# EasyEDA Pro project IMU_Splitter.eprj

# Schematic Schematic1
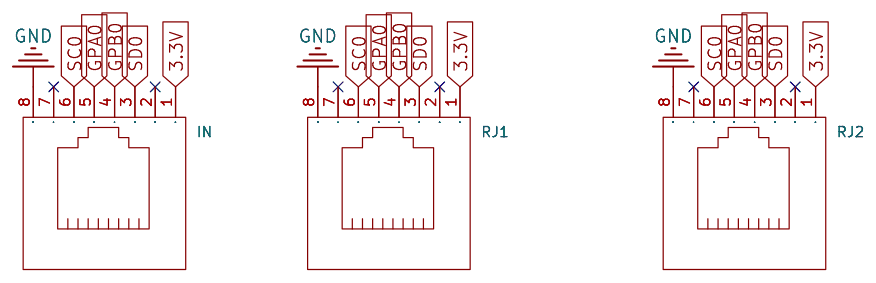
[diagram p0: schematic sheet]

## Parts
IN  -  [RJ45-TH_R-RJ45R08P-A009]
RJ1  -  [RJ45-TH_R-RJ45R08P-A009]
RJ2  -  [RJ45-TH_R-RJ45R08P-A009]

## Library data of the parts
IN RJ1 RJ2 = R-RJ45R08P-A009: Supplier Part: C2902700; Manufacturer: Ckmtw(灿科盟); Supplier Footprint: 插件; JLCPCB Part Class: Extended Part; Datasheet: https://atta.szlcsc.com/upload/public/pdf/source/20211021/D54662BD8381AD1D1DF920996089EE18.pdf; Supplier: LCSC

## Nets
3.3V: IN.1 RJ1.1 RJ2.1
GND: IN.8 RJ1.8 RJ2.8
GPA0: IN.5 RJ1.5 RJ2.5
GPB0: IN.4 RJ1.4 RJ2.4
SC0: IN.6 RJ1.6 RJ2.6
SD0: IN.3 RJ1.3 RJ2.3

Not connected (* = marked no-connect by the designer): IN 2* 7*; RJ1 2* 7*; RJ2 2* 7*

# Schematic Schematic2
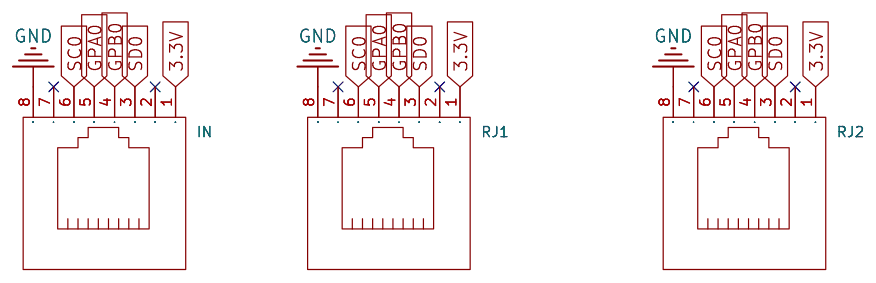
[diagram p1: schematic sheet]

## Parts
IN  -  [RJ45-TH_R-RJ45R08P-A009]
RJ1  -  [RJ45-TH_R-RJ45R08P-A009]
RJ2  -  [RJ45-TH_R-RJ45R08P-A009]

## Library data of the parts
IN RJ1 RJ2 = R-RJ45R08P-A009: Supplier Part: C2902700; Manufacturer: Ckmtw(灿科盟); Supplier Footprint: 插件; JLCPCB Part Class: Extended Part; Datasheet: https://atta.szlcsc.com/upload/public/pdf/source/20211021/D54662BD8381AD1D1DF920996089EE18.pdf; Supplier: LCSC

## Nets
3.3V: IN.1 RJ1.1 RJ2.1
GND: IN.8 RJ1.8 RJ2.8
GPA0: IN.5 RJ1.5 RJ2.5
GPB0: IN.4 RJ1.4 RJ2.4
SC0: IN.6 RJ1.6 RJ2.6
SD0: IN.3 RJ1.3 RJ2.3

Not connected (* = marked no-connect by the designer): IN 2* 7*; RJ1 2* 7*; RJ2 2* 7*

# Board PCB1
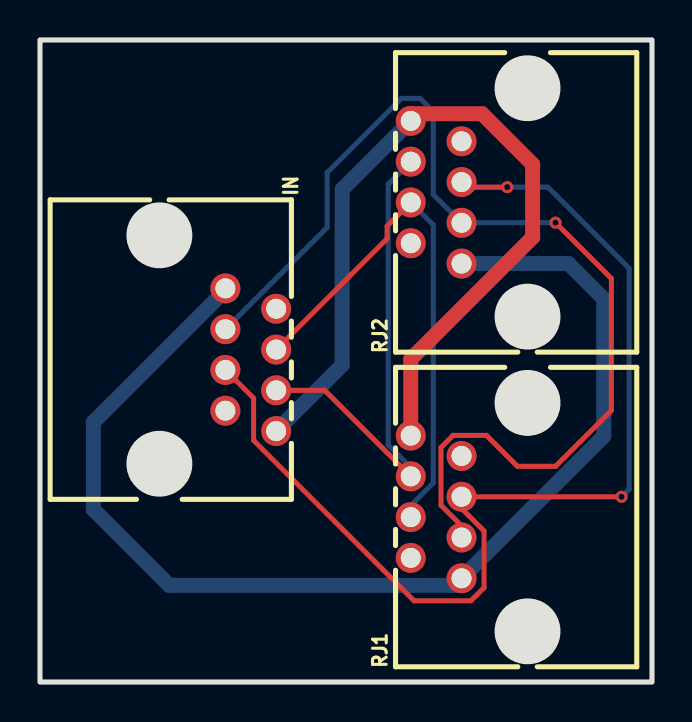
[diagram p2: board, top side]
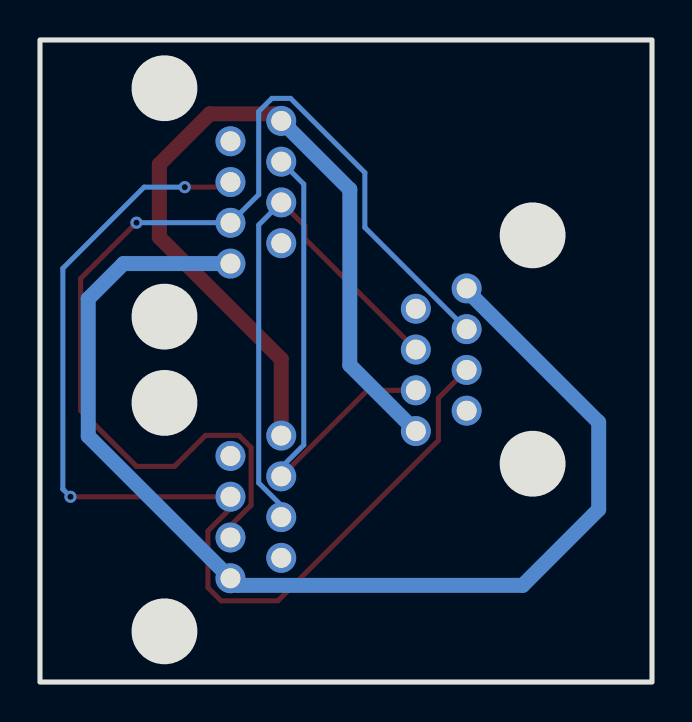
[diagram p3: board, bottom side, seen from below]

Outline 30.61 x 32.13 mm; copper layers: Top Layer, Bottom Layer. Coordinates in mm from the lower left corner of the outline.
Outline path: rectangle 0,32.13 30.61,0
Stack: Top Layer 0.035mm / Dielectric1 1.51mm FR4 er 4.5 / Bottom Layer 0.035mm

## Design rules (mm)
spacing safeClearance (default): track to track 0.152, other pairs 0.152 to 0.3
spacing safeClearance1: track to track 0.25, other pairs 0.25 to 0.5
track width trackWidth (default): min 0.127, default 0.254, max 2.54
track width trackWidth1: min 0.127, default 0.75, max 2.54
differential pair differentialPair (default): width min 0.127, default 0.254, max 2.54; gap min 0.152, default 0.152
via viaSize (default): diameter min 0.5, default 0.61, max 10; hole min 0.3, default 0.305, max 6
net 3.3V uses safeClearance1, trackWidth1
net GND uses safeClearance1, trackWidth1

## Placement (name value [footprint] x y rotation side)
IN  -  [RJ45-TH_R-RJ45R08P-A009]  10.54 16.13 270 top
RJ1  -  [RJ45-TH_R-RJ45R08P-A009]  19.81 8.76 90 top
RJ2  -  [RJ45-TH_R-RJ45R08P-A009]  19.81 24.51 90 top

## Footprints (pads in the part's own frame, mm; a bottom-side part is the same pattern mirrored in y, then rotated)
RJ45-TH_R-RJ45R08P-A009
  round 1.5 hole 1: 1(3.57,1.27) 2(2.55,-1.27) 3(1.53,1.27) 4(0.51,-1.27) 5(-0.51,1.27) 6(-1.53,-1.27) 7(-2.55,1.27) 8(-3.57,-1.27)

## Nets
As in the schematic.

Pads without a net: IN 2 7; RJ1 2 7; RJ2 2 7

## Via types
v1: diameter 0.61, hole 0.305, Top Layer to Bottom Layer, 4 vias

## Routing (per net, layer and track width the routed paths; a pad name or vN(x,y) marks a point on that pad's centre or on a via; arc(x,y) is an arc through that point)
3.3V: length 41.7
  Top Layer w0.75: RJ2.1 18.9,28.44 22.11,28.44 24.64,25.91 24.64,22.25 18.54,16.16 RJ1.1
  Bottom Layer w0.75: IN.1 15.11,15.86 15.11,24.65 RJ2.1
GND: length 58.7
  Bottom Layer w0.75: IN.8 9.27,19.6 2.67,13 2.67,8.64 6.47,4.84 20.73,4.84 28.19,12.31 28.19,19.18 26.43,20.94 RJ2.8
GPA0: length 26.8
  Top Layer w0.254: RJ2.5 17.36,22.82 17.36,22.19 IN.5
  Bottom Layer w0.254: RJ1.5 18.54,8.84 19.67,9.97 19.67,22.87 RJ2.5
GPB0: length 54
  Top Layer w0.254: v1(21.08,25.02) 21.34,24.77 v1(23.37,24.77) ; v1(29.08,9.27) 21.08,9.27 RJ1.4 21.08,8.69 22.21,7.56 22.21,4.73 21.55,4.07 18.71,4.07 10.68,12.09 10.68,14.21 IN.4
  Bottom Layer w0.254: v1(29.08,9.27) 29.46,9.65 29.46,20.7 25.4,24.77 v1(23.37,24.77)
SC0: length 54
  Top Layer w0.254: v1(25.78,22.99) 28.57,20.19 28.57,13.59 25.78,10.8 23.88,10.8 22.33,12.34 20.66,12.34 20.05,11.74 20.05,8.85 21.08,7.82 RJ1.6
  Bottom Layer w0.254: v1(25.78,22.99) 21.09,22.99 RJ2.6 19.67,24.39 19.67,28.55 19.01,29.21 18.07,29.21 14.36,25.49 14.36,22.75 IN.6
SD0: length 25.2
  Top Layer w0.254: IN.3 14.24,14.6 RJ1.3
  Bottom Layer w0.254: RJ1.3 18.54,10.74 17.41,11.87 17.41,24.91 RJ2.3
